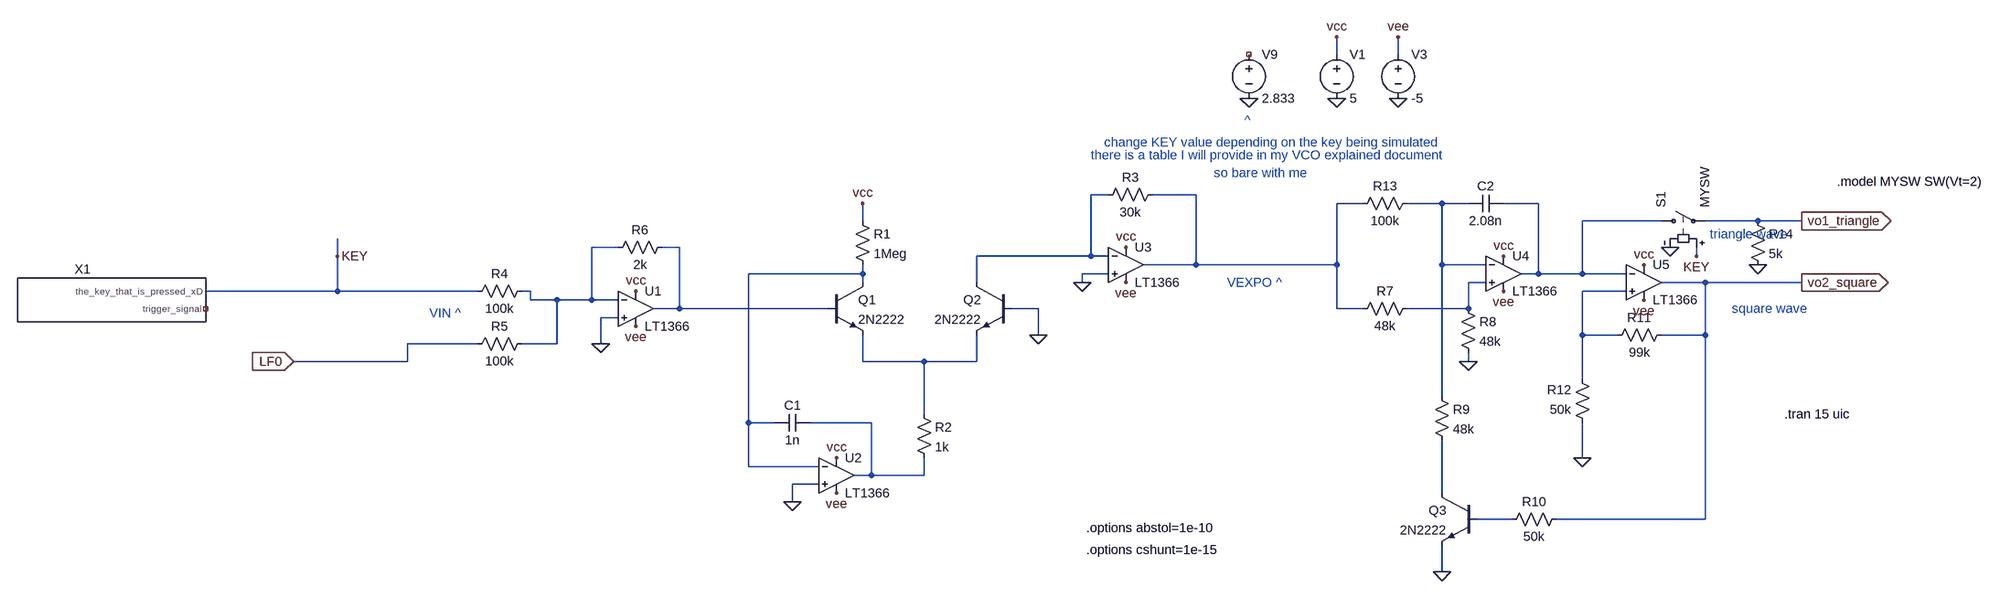
[diagram p0: schematic VCOComplete+exp_converter_block.asc]
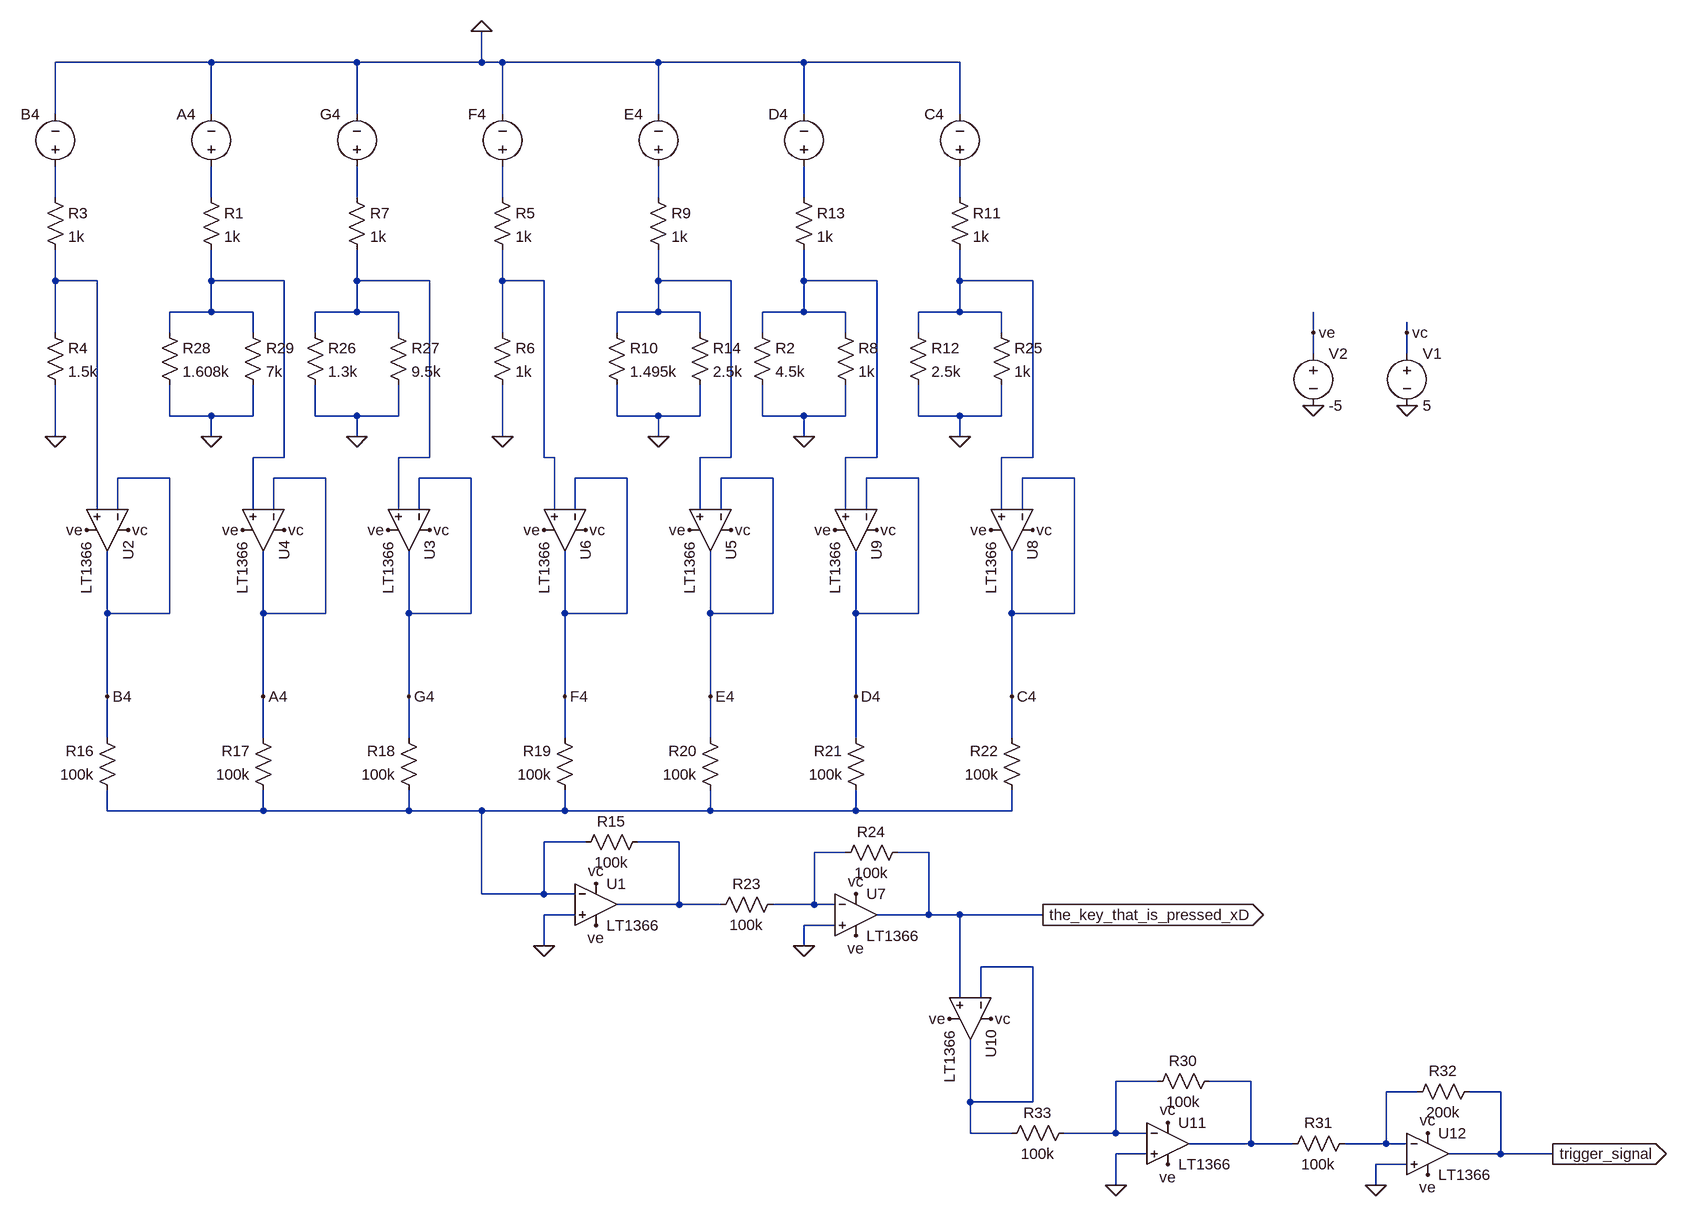
[diagram p1: sub-circuit key_input_with_trigger.asc]
VCOComplete+exp_converter_block.asc, the LTspice schematic file:
Version 4
SHEET 1 4136 976
WIRE 1056 -432 1056 -464
WIRE 1168 -432 1168 -464
WIRE 640 -176 608 -176
WIRE 800 -176 720 -176
WIRE 1104 -160 1056 -160
WIRE 1248 -160 1184 -160
WIRE 1296 -160 1248 -160
WIRE 1424 -160 1360 -160
WIRE 192 -128 192 -160
WIRE 1648 -128 1504 -128
WIRE 1824 -128 1728 -128
WIRE 1904 -128 1824 -128
WIRE -352 -80 -400 -80
WIRE -240 -80 -272 -80
WIRE -864 -64 -864 -96
WIRE 608 -64 608 -176
WIRE 608 -64 400 -64
WIRE 640 -64 608 -64
WIRE 1712 -64 1712 -80
WIRE 800 -48 800 -176
WIRE 800 -48 704 -48
WIRE 1056 -48 1056 -160
WIRE 1056 -48 800 -48
WIRE 1248 -48 1248 -160
WIRE 1328 -48 1248 -48
WIRE 192 -32 192 -48
WIRE 192 -32 -16 -32
WIRE 640 -32 592 -32
WIRE 1424 -32 1424 -160
WIRE 1424 -32 1392 -32
WIRE 1504 -32 1504 -128
WIRE 1504 -32 1424 -32
WIRE 1584 -32 1504 -32
WIRE 192 -16 192 -32
WIRE 400 -16 400 -64
WIRE 592 -16 592 -32
WIRE 1328 -16 1296 -16
WIRE 1728 -16 1648 -16
WIRE 1904 -16 1728 -16
WIRE -864 0 -864 -64
WIRE -864 0 -1104 0
WIRE -608 0 -864 0
WIRE -512 0 -528 0
WIRE 1584 0 1504 0
WIRE -512 16 -512 0
WIRE -464 16 -512 16
WIRE -400 16 -400 -80
WIRE -400 16 -464 16
WIRE -352 16 -400 16
WIRE -240 32 -240 -80
WIRE -240 32 -288 32
WIRE 128 32 -240 32
WIRE 512 32 464 32
WIRE 1056 32 1056 -48
WIRE 1104 32 1056 32
WIRE 1296 32 1296 -16
WIRE 1296 32 1184 32
WIRE -352 48 -384 48
WIRE 512 80 512 32
WIRE 1504 80 1504 0
WIRE 1568 80 1504 80
WIRE 1728 80 1728 -16
WIRE 1728 80 1648 80
WIRE -608 96 -736 96
WIRE -464 96 -464 16
WIRE -464 96 -528 96
WIRE -384 96 -384 48
WIRE -736 128 -736 96
WIRE -736 128 -944 128
WIRE 192 128 192 80
WIRE 304 128 192 128
WIRE 400 128 400 80
WIRE 400 128 304 128
WIRE 1296 128 1296 112
WIRE 1504 160 1504 80
WIRE 1248 192 1248 -48
WIRE 304 224 304 128
WIRE -16 240 -16 -32
WIRE 32 240 -16 240
WIRE 208 240 96 240
WIRE 1504 304 1504 240
WIRE -16 320 -16 240
WIRE 112 320 -16 320
WIRE 208 336 208 240
WIRE 208 336 176 336
WIRE 304 336 304 304
WIRE 304 336 208 336
WIRE 112 352 64 352
WIRE 1248 368 1248 272
WIRE 64 384 64 352
WIRE 1376 416 1312 416
WIRE 1728 416 1728 80
WIRE 1728 416 1456 416
WIRE 1248 512 1248 464
FLAG 512 80 0
FLAG 192 -160 vcc
FLAG 64 384 0
FLAG 592 -16 0
FLAG 672 -80 vcc
FLAG 1056 -352 0
FLAG 1056 -464 vcc
FLAG 1168 -352 0
FLAG 1168 -464 vee
FLAG 672 -16 vee
FLAG 144 304 vcc
FLAG 144 368 vee
FLAG -320 0 vcc
FLAG -384 96 0
FLAG 1360 -64 vcc
FLAG 1616 -48 vcc
FLAG 1904 -128 vo1_triangle
IOPIN 1904 -128 Out
FLAG 1904 -16 vo2_square
IOPIN 1904 -16 Out
FLAG 1296 128 0
FLAG 1248 512 0
FLAG 1616 16 vee
FLAG 1360 0 vee
FLAG -320 64 vee
FLAG 896 -352 0
FLAG 1504 304 0
FLAG -944 128 LF0
IOPIN -944 128 In
FLAG -864 -64 KEY
FLAG 1712 -64 KEY
FLAG 1664 -80 0
FLAG 1824 -48 0
SYMBOL res 176 -144 R0
SYMATTR InstName R1
SYMATTR Value 1Meg
SYMBOL cap 96 224 R90
WINDOW 0 0 32 VBottom 2
WINDOW 3 32 32 VTop 2
SYMATTR InstName C1
SYMATTR Value 1n
SYMBOL res 288 208 R0
SYMATTR InstName R2
SYMATTR Value 1k
SYMBOL res 736 -192 R90
WINDOW 0 0 56 VBottom 2
WINDOW 3 32 56 VTop 2
SYMATTR InstName R3
SYMATTR Value 30k
SYMBOL voltage 1056 -448 R0
SYMATTR InstName V1
SYMATTR Value 5
SYMBOL voltage 1168 -448 R0
SYMATTR InstName V3
SYMATTR Value -5
SYMBOL res -512 -16 R90
WINDOW 0 0 56 VBottom 2
WINDOW 3 32 56 VTop 2
SYMATTR InstName R4
SYMATTR Value 100k
SYMBOL res -512 80 R90
WINDOW 0 0 56 VBottom 2
WINDOW 3 32 56 VTop 2
SYMATTR InstName R5
SYMATTR Value 100k
SYMBOL res -256 -96 R90
WINDOW 0 0 56 VBottom 2
WINDOW 3 32 56 VTop 2
SYMATTR InstName R6
SYMATTR Value 2k
SYMBOL cap 1360 -176 R90
WINDOW 0 0 32 VBottom 2
WINDOW 3 32 32 VTop 2
SYMATTR InstName C2
SYMATTR Value 2.08n
SYMBOL res 1200 16 R90
WINDOW 0 0 56 VBottom 2
WINDOW 3 32 56 VTop 2
SYMATTR InstName R7
SYMATTR Value 48k
SYMBOL res 1280 16 R0
SYMATTR InstName R8
SYMATTR Value 48k
SYMBOL res 1232 176 R0
SYMATTR InstName R9
SYMATTR Value 48k
SYMBOL npn 1312 368 M0
SYMATTR InstName Q3
SYMATTR Value 2N2222
SYMBOL res 1472 400 R90
WINDOW 0 0 56 VBottom 2
WINDOW 3 32 56 VTop 2
SYMATTR InstName R10
SYMATTR Value 50k
SYMBOL res 1664 64 R90
WINDOW 0 0 56 VBottom 2
WINDOW 3 32 56 VTop 2
SYMATTR InstName R11
SYMATTR Value 99k
SYMBOL res 1520 256 R180
WINDOW 0 36 76 Left 2
WINDOW 3 36 40 Left 2
SYMATTR InstName R12
SYMATTR Value 50k
SYMBOL res 1200 -176 R90
WINDOW 0 0 56 VBottom 2
WINDOW 3 32 56 VTop 2
SYMATTR InstName R13
SYMATTR Value 100k
SYMBOL npn 128 -16 R0
SYMATTR InstName Q1
SYMATTR Value 2N2222
SYMBOL npn 464 -16 M0
SYMATTR InstName Q2
SYMATTR Value 2N2222
SYMBOL LT1366 -320 -32 R0
SYMATTR InstName U1
SYMBOL LT1366 144 272 R0
SYMATTR InstName U2
SYMBOL LT1366 672 -112 R0
SYMATTR InstName U3
SYMBOL LT1366 1360 -96 R0
SYMATTR InstName U4
SYMBOL LT1366 1616 -80 R0
SYMATTR InstName U5
SYMBOL voltage 896 -448 R0
WINDOW 123 0 0 Left 2
WINDOW 39 0 0 Left 2
SYMATTR InstName V9
SYMATTR Value 2.833
SYMBOL Key_Input_with_trigger -1328 16 R0
SYMATTR InstName X1
SYMBOL sw 1632 -128 R270
SYMATTR InstName S1
SYMATTR Value MYSW
SYMBOL res 1808 -144 R0
SYMATTR InstName R14
SYMATTR Value 5k
TEXT 856 -16 Left 2 ;VEXPO ^
TEXT -696 40 Left 2 ;VIN ^
TEXT 1776 32 Left 2 ;square wave
TEXT 1736 -104 Left 2 ;triangle wave
TEXT 632 -272 Left 2 ;change KEY value depending on the key being simulated
TEXT 888 -312 Left 2 ;^
TEXT 608 -248 Left 2 ;there is a table I will provide in my VCO explained document
TEXT 832 -216 Left 2 ;so bare with me
TEXT 600 432 Left 2 !.options abstol=1e-10
TEXT 600 472 Left 2 !.options cshunt=1e-15
TEXT 1872 224 Left 2 !.tran 15 uic
TEXT 1968 -200 Left 2 !.model MYSW SW(Vt=2)

key_input_with_trigger.asc, the sub-circuit schematic file:
Version 4
SHEET 1 1488 1832
WIRE -800 48 -1040 48
WIRE -576 48 -800 48
WIRE -384 48 -384 0
WIRE -384 48 -576 48
WIRE -352 48 -384 48
WIRE -112 48 -352 48
WIRE 112 48 -112 48
WIRE 352 48 112 48
WIRE -1040 128 -1040 48
WIRE -800 128 -800 48
WIRE -576 128 -576 48
WIRE -352 128 -352 48
WIRE -112 128 -112 48
WIRE 112 128 112 48
WIRE 352 128 352 48
WIRE -1040 256 -1040 208
WIRE -800 256 -800 208
WIRE -576 256 -576 208
WIRE -352 256 -352 208
WIRE -112 256 -112 208
WIRE 112 256 112 208
WIRE 352 256 352 208
WIRE -1040 384 -1040 336
WIRE -976 384 -1040 384
WIRE -800 384 -800 336
WIRE -688 384 -800 384
WIRE -576 384 -576 336
WIRE -464 384 -576 384
WIRE -352 384 -352 336
WIRE -288 384 -352 384
WIRE -112 384 -112 336
WIRE 0 384 -112 384
WIRE 112 384 112 336
WIRE 224 384 112 384
WIRE 352 384 352 336
WIRE 464 384 352 384
WIRE -800 432 -800 384
WIRE -800 432 -864 432
WIRE -736 432 -800 432
WIRE -576 432 -576 384
WIRE -576 432 -640 432
WIRE -512 432 -576 432
WIRE -112 432 -112 384
WIRE -112 432 -176 432
WIRE -48 432 -112 432
WIRE 112 432 112 384
WIRE 112 432 48 432
WIRE 176 432 112 432
WIRE 352 432 352 384
WIRE 352 432 288 432
WIRE 416 432 352 432
WIRE -1040 464 -1040 384
WIRE -864 464 -864 432
WIRE -736 464 -736 432
WIRE -640 464 -640 432
WIRE -512 464 -512 432
WIRE -352 464 -352 384
WIRE -176 464 -176 432
WIRE -48 464 -48 432
WIRE 48 464 48 432
WIRE 176 464 176 432
WIRE 288 464 288 432
WIRE 416 464 416 432
WIRE 896 464 896 432
WIRE 1040 464 1040 448
WIRE 896 496 896 464
WIRE 1040 496 1040 464
WIRE -864 592 -864 544
WIRE -800 592 -864 592
WIRE -736 592 -736 544
WIRE -736 592 -800 592
WIRE -640 592 -640 544
WIRE -576 592 -640 592
WIRE -512 592 -512 544
WIRE -512 592 -576 592
WIRE -176 592 -176 544
WIRE -112 592 -176 592
WIRE -48 592 -48 544
WIRE -48 592 -112 592
WIRE 48 592 48 544
WIRE 112 592 48 592
WIRE 176 592 176 544
WIRE 176 592 112 592
WIRE 288 592 288 544
WIRE 352 592 288 592
WIRE 416 592 416 544
WIRE 416 592 352 592
WIRE -1040 624 -1040 544
WIRE -800 624 -800 592
WIRE -576 624 -576 592
WIRE -352 624 -352 544
WIRE -112 624 -112 592
WIRE 112 624 112 592
WIRE 352 624 352 592
WIRE -688 656 -688 384
WIRE -688 656 -736 656
WIRE -464 656 -464 384
WIRE -464 656 -512 656
WIRE -288 656 -288 384
WIRE -272 656 -288 656
WIRE 0 656 0 384
WIRE 0 656 -48 656
WIRE 224 656 224 384
WIRE 224 656 176 656
WIRE 464 656 464 384
WIRE 464 656 416 656
WIRE -864 688 -944 688
WIRE -624 688 -704 688
WIRE -400 688 -480 688
WIRE -160 688 -240 688
WIRE 64 688 -16 688
WIRE 288 688 208 688
WIRE 528 688 448 688
WIRE -976 736 -976 384
WIRE -944 736 -944 688
WIRE -736 736 -736 656
WIRE -704 736 -704 688
WIRE -512 736 -512 656
WIRE -480 736 -480 688
WIRE -272 736 -272 656
WIRE -240 736 -240 688
WIRE -48 736 -48 656
WIRE -16 736 -16 688
WIRE 176 736 176 656
WIRE 208 736 208 688
WIRE 416 736 416 656
WIRE 448 736 448 688
WIRE -960 896 -960 800
WIRE -864 896 -864 688
WIRE -864 896 -960 896
WIRE -720 896 -720 800
WIRE -624 896 -624 688
WIRE -624 896 -720 896
WIRE -496 896 -496 800
WIRE -400 896 -400 688
WIRE -400 896 -496 896
WIRE -256 896 -256 800
WIRE -160 896 -160 688
WIRE -160 896 -256 896
WIRE -32 896 -32 800
WIRE 64 896 64 688
WIRE 64 896 -32 896
WIRE 192 896 192 800
WIRE 288 896 288 688
WIRE 288 896 192 896
WIRE 432 896 432 800
WIRE 528 896 528 688
WIRE 528 896 432 896
WIRE -960 1024 -960 896
WIRE -720 1024 -720 896
WIRE -496 1024 -496 896
WIRE -256 1024 -256 896
WIRE -32 1024 -32 896
WIRE 192 1024 192 896
WIRE 432 1024 432 896
WIRE -960 1088 -960 1024
WIRE -720 1088 -720 1024
WIRE -496 1088 -496 1024
WIRE -256 1088 -256 1024
WIRE -32 1088 -32 1024
WIRE 192 1088 192 1024
WIRE 432 1088 432 1024
WIRE -960 1200 -960 1168
WIRE -720 1200 -720 1168
WIRE -720 1200 -960 1200
WIRE -496 1200 -496 1168
WIRE -496 1200 -720 1200
WIRE -384 1200 -496 1200
WIRE -256 1200 -256 1168
WIRE -256 1200 -384 1200
WIRE -32 1200 -32 1168
WIRE -32 1200 -256 1200
WIRE 192 1200 192 1168
WIRE 192 1200 -32 1200
WIRE 432 1200 432 1168
WIRE 432 1200 192 1200
WIRE -224 1248 -288 1248
WIRE -80 1248 -144 1248
WIRE 176 1264 128 1264
WIRE 304 1264 256 1264
WIRE -384 1328 -384 1200
WIRE -288 1328 -288 1248
WIRE -288 1328 -384 1328
WIRE -240 1328 -288 1328
WIRE -80 1344 -80 1248
WIRE -80 1344 -176 1344
WIRE -16 1344 -80 1344
WIRE 128 1344 128 1264
WIRE 128 1344 64 1344
WIRE 160 1344 128 1344
WIRE -240 1360 -288 1360
WIRE 304 1360 304 1264
WIRE 304 1360 224 1360
WIRE 352 1360 304 1360
WIRE 480 1360 352 1360
WIRE 160 1376 112 1376
WIRE -288 1408 -288 1360
WIRE 112 1408 112 1376
WIRE 464 1440 384 1440
WIRE 352 1488 352 1360
WIRE 384 1488 384 1440
WIRE 656 1616 592 1616
WIRE 800 1616 736 1616
WIRE 1056 1632 1008 1632
WIRE 1184 1632 1136 1632
WIRE 368 1648 368 1552
WIRE 464 1648 464 1440
WIRE 464 1648 368 1648
WIRE 368 1696 368 1648
WIRE 432 1696 368 1696
WIRE 592 1696 592 1616
WIRE 592 1696 512 1696
WIRE 640 1696 592 1696
WIRE 800 1712 800 1616
WIRE 800 1712 704 1712
WIRE 864 1712 800 1712
WIRE 1008 1712 1008 1632
WIRE 1008 1712 944 1712
WIRE 1040 1712 1008 1712
WIRE 640 1728 592 1728
WIRE 1184 1728 1184 1632
WIRE 1184 1728 1104 1728
WIRE 1264 1728 1184 1728
WIRE 1040 1744 992 1744
WIRE 592 1776 592 1728
WIRE 992 1776 992 1744
FLAG -384 0 0
FLAG 432 1024 C4
FLAG 192 1024 D4
FLAG -32 1024 E4
FLAG -256 1024 F4
FLAG -496 1024 G4
FLAG -720 1024 A4
FLAG -960 1024 B4
FLAG -288 1408 0
FLAG 1040 576 0
FLAG 1040 464 vc
FLAG 896 576 0
FLAG 896 464 ve
FLAG 464 768 vc
FLAG 224 768 vc
FLAG 0 768 vc
FLAG -224 768 vc
FLAG -464 768 vc
FLAG -688 768 vc
FLAG -928 768 vc
FLAG -208 1312 vc
FLAG 400 768 ve
FLAG 160 768 ve
FLAG -64 768 ve
FLAG -288 768 ve
FLAG -528 768 ve
FLAG -752 768 ve
FLAG -992 768 ve
FLAG -208 1376 ve
FLAG 112 1408 0
FLAG 192 1328 vc
FLAG 192 1392 ve
FLAG 480 1360 the_key_that_is_pressed_xD
IOPIN 480 1360 Out
FLAG 352 624 0
FLAG 112 624 0
FLAG -112 624 0
FLAG -576 624 0
FLAG -800 624 0
FLAG -1040 624 0
FLAG -352 624 0
FLAG 1264 1728 trigger_signal
IOPIN 1264 1728 Out
FLAG 400 1520 vc
FLAG 336 1520 ve
FLAG 592 1776 0
FLAG 672 1680 vc
FLAG 672 1744 ve
FLAG 992 1776 0
FLAG 1072 1696 vc
FLAG 1072 1760 ve
SYMBOL res -816 240 R0
SYMATTR InstName R1
SYMATTR Value 1k
SYMBOL res -1056 240 R0
SYMATTR InstName R3
SYMATTR Value 1k
SYMBOL res -1056 448 R0
SYMATTR InstName R4
SYMATTR Value 1.5k
SYMBOL res -368 240 R0
SYMATTR InstName R5
SYMATTR Value 1k
SYMBOL res -368 448 R0
SYMATTR InstName R6
SYMATTR Value 1k
SYMBOL res -592 240 R0
SYMATTR InstName R7
SYMATTR Value 1k
SYMBOL res -128 240 R0
SYMATTR InstName R9
SYMATTR Value 1k
SYMBOL res 336 240 R0
SYMATTR InstName R11
SYMATTR Value 1k
SYMBOL res 96 240 R0
SYMATTR InstName R13
SYMATTR Value 1k
SYMBOL voltage -1040 224 R180
WINDOW 0 24 96 Left 2
WINDOW 3 24 16 Invisible 2
WINDOW 123 0 0 Left 0
WINDOW 39 0 0 Left 0
SYMATTR InstName B4
SYMATTR Value PWL(30.499999999999 0 30.5 5 35 5 35.000000000001 0)
SYMBOL voltage -800 224 R180
WINDOW 0 24 96 Left 2
WINDOW 3 24 16 Invisible 2
WINDOW 123 0 0 Left 0
WINDOW 39 0 0 Left 0
SYMATTR InstName A4
SYMATTR Value PWL(25.499999999999 0 25.5 5 30 5 30.000000000001 0)
SYMBOL voltage -576 224 R180
WINDOW 0 24 96 Left 2
WINDOW 3 24 68 Invisible 2
WINDOW 123 0 0 Left 0
WINDOW 39 0 0 Left 0
SYMATTR InstName G4
SYMATTR Value PWL(20.499999999999 0 20.5 5 25 5 25.000000000001 0)
SYMBOL voltage -352 224 R180
WINDOW 0 24 96 Left 2
WINDOW 3 24 68 Invisible 2
WINDOW 123 0 0 Left 0
WINDOW 39 0 0 Left 0
SYMATTR InstName F4
SYMATTR Value PWL(15.499999999999 0 15.5 5 20 5 20.000000000001 0)
SYMBOL voltage -112 224 R180
WINDOW 0 24 96 Left 2
WINDOW 3 24 68 Invisible 2
WINDOW 123 0 0 Left 0
WINDOW 39 0 0 Left 0
SYMATTR InstName E4
SYMATTR Value PWL(10.499999999999 0 10.5 5 15 5 15.000000000001 0)
SYMBOL voltage 112 224 R180
WINDOW 0 24 96 Left 2
WINDOW 3 24 74 Invisible 2
WINDOW 123 0 0 Left 0
WINDOW 39 0 0 Left 0
SYMATTR InstName D4
SYMATTR Value PWL(5.499999999999 0 5.5 5 10 5 10.000000000001 0)
SYMBOL voltage 352 224 R180
WINDOW 0 24 96 Left 2
WINDOW 3 24 68 Invisible 2
WINDOW 123 0 0 Left 0
WINDOW 39 0 0 Left 0
SYMATTR InstName C4
SYMATTR Value PWL(0 0 0.049999999999 0 0.05 5 5 5 5.000000000001 0)
SYMBOL LT1366 -208 1280 R0
SYMATTR InstName U1
SYMBOL res -128 1232 R90
WINDOW 0 0 56 VBottom 2
WINDOW 3 32 56 VTop 2
SYMATTR InstName R15
SYMATTR Value 100k
SYMBOL res -944 1184 R180
WINDOW 0 36 76 Left 2
WINDOW 3 36 40 Left 2
SYMATTR InstName R16
SYMATTR Value 100k
SYMBOL res -704 1184 R180
WINDOW 0 36 76 Left 2
WINDOW 3 36 40 Left 2
SYMATTR InstName R17
SYMATTR Value 100k
SYMBOL res -480 1184 R180
WINDOW 0 36 76 Left 2
WINDOW 3 36 40 Left 2
SYMATTR InstName R18
SYMATTR Value 100k
SYMBOL res -240 1184 R180
WINDOW 0 36 76 Left 2
WINDOW 3 36 40 Left 2
SYMATTR InstName R19
SYMATTR Value 100k
SYMBOL res -16 1184 R180
WINDOW 0 36 76 Left 2
WINDOW 3 36 40 Left 2
SYMATTR InstName R20
SYMATTR Value 100k
SYMBOL res 208 1184 R180
WINDOW 0 36 76 Left 2
WINDOW 3 36 40 Left 2
SYMATTR InstName R21
SYMATTR Value 100k
SYMBOL res 448 1184 R180
WINDOW 0 36 76 Left 2
WINDOW 3 36 40 Left 2
SYMATTR InstName R22
SYMATTR Value 100k
SYMBOL LT1366 -432 768 R90
SYMATTR InstName U3
SYMBOL LT1366 -896 768 R90
SYMATTR InstName U2
SYMBOL LT1366 -656 768 R90
SYMATTR InstName U4
SYMBOL LT1366 32 768 R90
SYMATTR InstName U5
SYMBOL LT1366 -192 768 R90
SYMATTR InstName U6
SYMBOL LT1366 496 768 R90
SYMATTR InstName U8
SYMBOL LT1366 256 768 R90
SYMATTR InstName U9
SYMBOL voltage 1040 480 R0
SYMATTR InstName V1
SYMATTR Value 5
SYMBOL voltage 896 480 R0
SYMATTR InstName V2
SYMATTR Value -5
SYMBOL LT1366 192 1296 R0
SYMATTR InstName U7
SYMBOL res 80 1328 R90
WINDOW 0 0 56 VBottom 2
WINDOW 3 32 56 VTop 2
SYMATTR InstName R23
SYMATTR Value 100k
SYMBOL res 272 1248 R90
WINDOW 0 0 56 VBottom 2
WINDOW 3 32 56 VTop 2
SYMATTR InstName R24
SYMATTR Value 100k
SYMBOL res 272 448 R0
SYMATTR InstName R12
SYMATTR Value 2.5k
SYMBOL res 400 448 R0
SYMATTR InstName R25
SYMATTR Value 1k
SYMBOL res 32 448 R0
SYMATTR InstName R2
SYMATTR Value 4.5k
SYMBOL res 160 448 R0
SYMATTR InstName R8
SYMATTR Value 1k
SYMBOL res -192 448 R0
SYMATTR InstName R10
SYMATTR Value 1.495k
SYMBOL res -64 448 R0
SYMATTR InstName R14
SYMATTR Value 2.5k
SYMBOL res -656 448 R0
SYMATTR InstName R26
SYMATTR Value 1.3k
SYMBOL res -528 448 R0
SYMATTR InstName R27
SYMATTR Value 9.5k
SYMBOL res -880 448 R0
SYMATTR InstName R28
SYMATTR Value 1.608k
SYMBOL res -752 448 R0
SYMATTR InstName R29
SYMATTR Value 7k
SYMBOL LT1366 432 1520 R90
SYMATTR InstName U10
SYMBOL LT1366 672 1648 R0
SYMATTR InstName U11
SYMBOL res 752 1600 R90
WINDOW 0 0 56 VBottom 2
WINDOW 3 32 56 VTop 2
SYMATTR InstName R30
SYMATTR Value 100k
SYMBOL LT1366 1072 1664 R0
SYMATTR InstName U12
SYMBOL res 960 1696 R90
WINDOW 0 0 56 VBottom 2
WINDOW 3 32 56 VTop 2
SYMATTR InstName R31
SYMATTR Value 100k
SYMBOL res 1152 1616 R90
WINDOW 0 0 56 VBottom 2
WINDOW 3 32 56 VTop 2
SYMATTR InstName R32
SYMATTR Value 200k
SYMBOL res 528 1680 R90
WINDOW 0 0 56 VBottom 2
WINDOW 3 32 56 VTop 2
SYMATTR InstName R33
SYMATTR Value 100k

The netlist it stands for:
* VCOComplete+exp_converter_block.asc
R1 vcc N007 1Meg
C1 N011 N007 1n
R2 N010 N011 1k
R3 N002 N001 30k
V1 vcc 0 5
V3 vee 0 -5
R4 N005 KEY 100k
R5 N005 LF0 100k
R6 N006 N005 2k
C2 N004 N003 2.08n
R7 N008 N002 48k
R8 N008 0 48k
R9 N003 N012 48k
Q3 N012 N013 0 0 2N2222
R10 vo2_square N013 50k
R11 vo2_square N009 99k
R12 0 N009 50k
R13 N003 N002 100k
Q1 N007 N006 N010 0 2N2222
Q2 N001 0 N010 0 2N2222
XU1 0 N005 vcc vee N006 LT1366  ; pins In+ In- V+ V- OUT
XU2 0 N007 vcc vee N011 LT1366  ; pins In+ In- V+ V- OUT
XU3 0 N001 vcc vee N002 LT1366  ; pins In+ In- V+ V- OUT
XU4 N008 N003 vcc vee N004 LT1366  ; pins In+ In- V+ V- OUT
XU5 N009 N004 vcc vee vo2_square LT1366  ; pins In+ In- V+ V- OUT
V9 NC_01 0 2.833
XX1 KEY NC_02 key_input_with_trigger
S1 N004 vo1_triangle KEY 0 MYSW
R14 vo1_triangle 0 5k

* block symbol definitions
.subckt key_input_with_trigger the_key_that_is_pressed_xD trigger_signal
R1 N002 N009 1k
R3 N001 N008 1k
R4 N008 0 1.5k
R5 N004 N011 1k
R6 N011 0 1k
R7 N003 N010 1k
R9 N005 N012 1k
R11 N007 N014 1k
R13 N006 N013 1k
V§B4 N001 0 PWL(30.499999999999 0 30.5 5 35 5 35.000000000001 0)
V§A4 N002 0 PWL(25.499999999999 0 25.5 5 30 5 30.000000000001 0)
V§G4 N003 0 PWL(20.499999999999 0 20.5 5 25 5 25.000000000001 0)
V§F4 N004 0 PWL(15.499999999999 0 15.5 5 20 5 20.000000000001 0)
V§E4 N005 0 PWL(10.499999999999 0 10.5 5 15 5 15.000000000001 0)
V§D4 N006 0 PWL(5.499999999999 0 5.5 5 10 5 10.000000000001 0)
V§C4 N007 0 PWL(0 0 0.049999999999 0 0.05 5 5 5 5.000000000001 0)
XU1 0 N015 vc ve N016 LT1366  ; pins In+ In- V+ V- OUT
R15 N016 N015 100k
R16 N015 B4 100k
R17 N015 A4 100k
R18 N015 G4 100k
R19 N015 F4 100k
R20 N015 E4 100k
R21 N015 D4 100k
R22 N015 C4 100k
XU3 N010 G4 vc ve G4 LT1366  ; pins In+ In- V+ V- OUT
XU2 N008 B4 vc ve B4 LT1366  ; pins In+ In- V+ V- OUT
XU4 N009 A4 vc ve A4 LT1366  ; pins In+ In- V+ V- OUT
XU5 N012 E4 vc ve E4 LT1366  ; pins In+ In- V+ V- OUT
XU6 N011 F4 vc ve F4 LT1366  ; pins In+ In- V+ V- OUT
XU8 N014 C4 vc ve C4 LT1366  ; pins In+ In- V+ V- OUT
XU9 N013 D4 vc ve D4 LT1366  ; pins In+ In- V+ V- OUT
V1 vc 0 5
V2 ve 0 -5
XU7 0 N017 vc ve the_key_that_is_pressed_xD LT1366  ; pins In+ In- V+ V- OUT
R23 N017 N016 100k
R24 the_key_that_is_pressed_xD N017 100k
R12 N014 0 2.5k
R25 N014 0 1k
R2 N013 0 4.5k
R8 N013 0 1k
R10 N012 0 1.495k
R14 N012 0 2.5k
R26 N010 0 1.3k
R27 N010 0 9.5k
R28 N009 0 1.608k
R29 N009 0 7k
XU10 the_key_that_is_pressed_xD N018 vc ve N018 LT1366  ; pins In+ In- V+ V- OUT
XU11 0 N019 vc ve N020 LT1366  ; pins In+ In- V+ V- OUT
R30 N020 N019 100k
XU12 0 N021 vc ve trigger_signal LT1366  ; pins In+ In- V+ V- OUT
R31 N021 N020 100k
R32 trigger_signal N021 200k
R33 N019 N018 100k
.ends key_input_with_trigger

.model NPN NPN
.model PNP PNP
.lib standard.bjt
* VEXPO ^
* VIN ^
* square wave
* triangle wave
* change KEY value depending on the key being simulated
* ^
* there is a table I will provide in my VCO explained document
* so bare with me
.options abstol=1e-10
.options cshunt=1e-15
.tran 15 uic
.model MYSW SW(Vt=2)
.lib LTC.lib
.backanno
.end